# Altium schematic sheet PCU_PCIe.SchDoc
size B
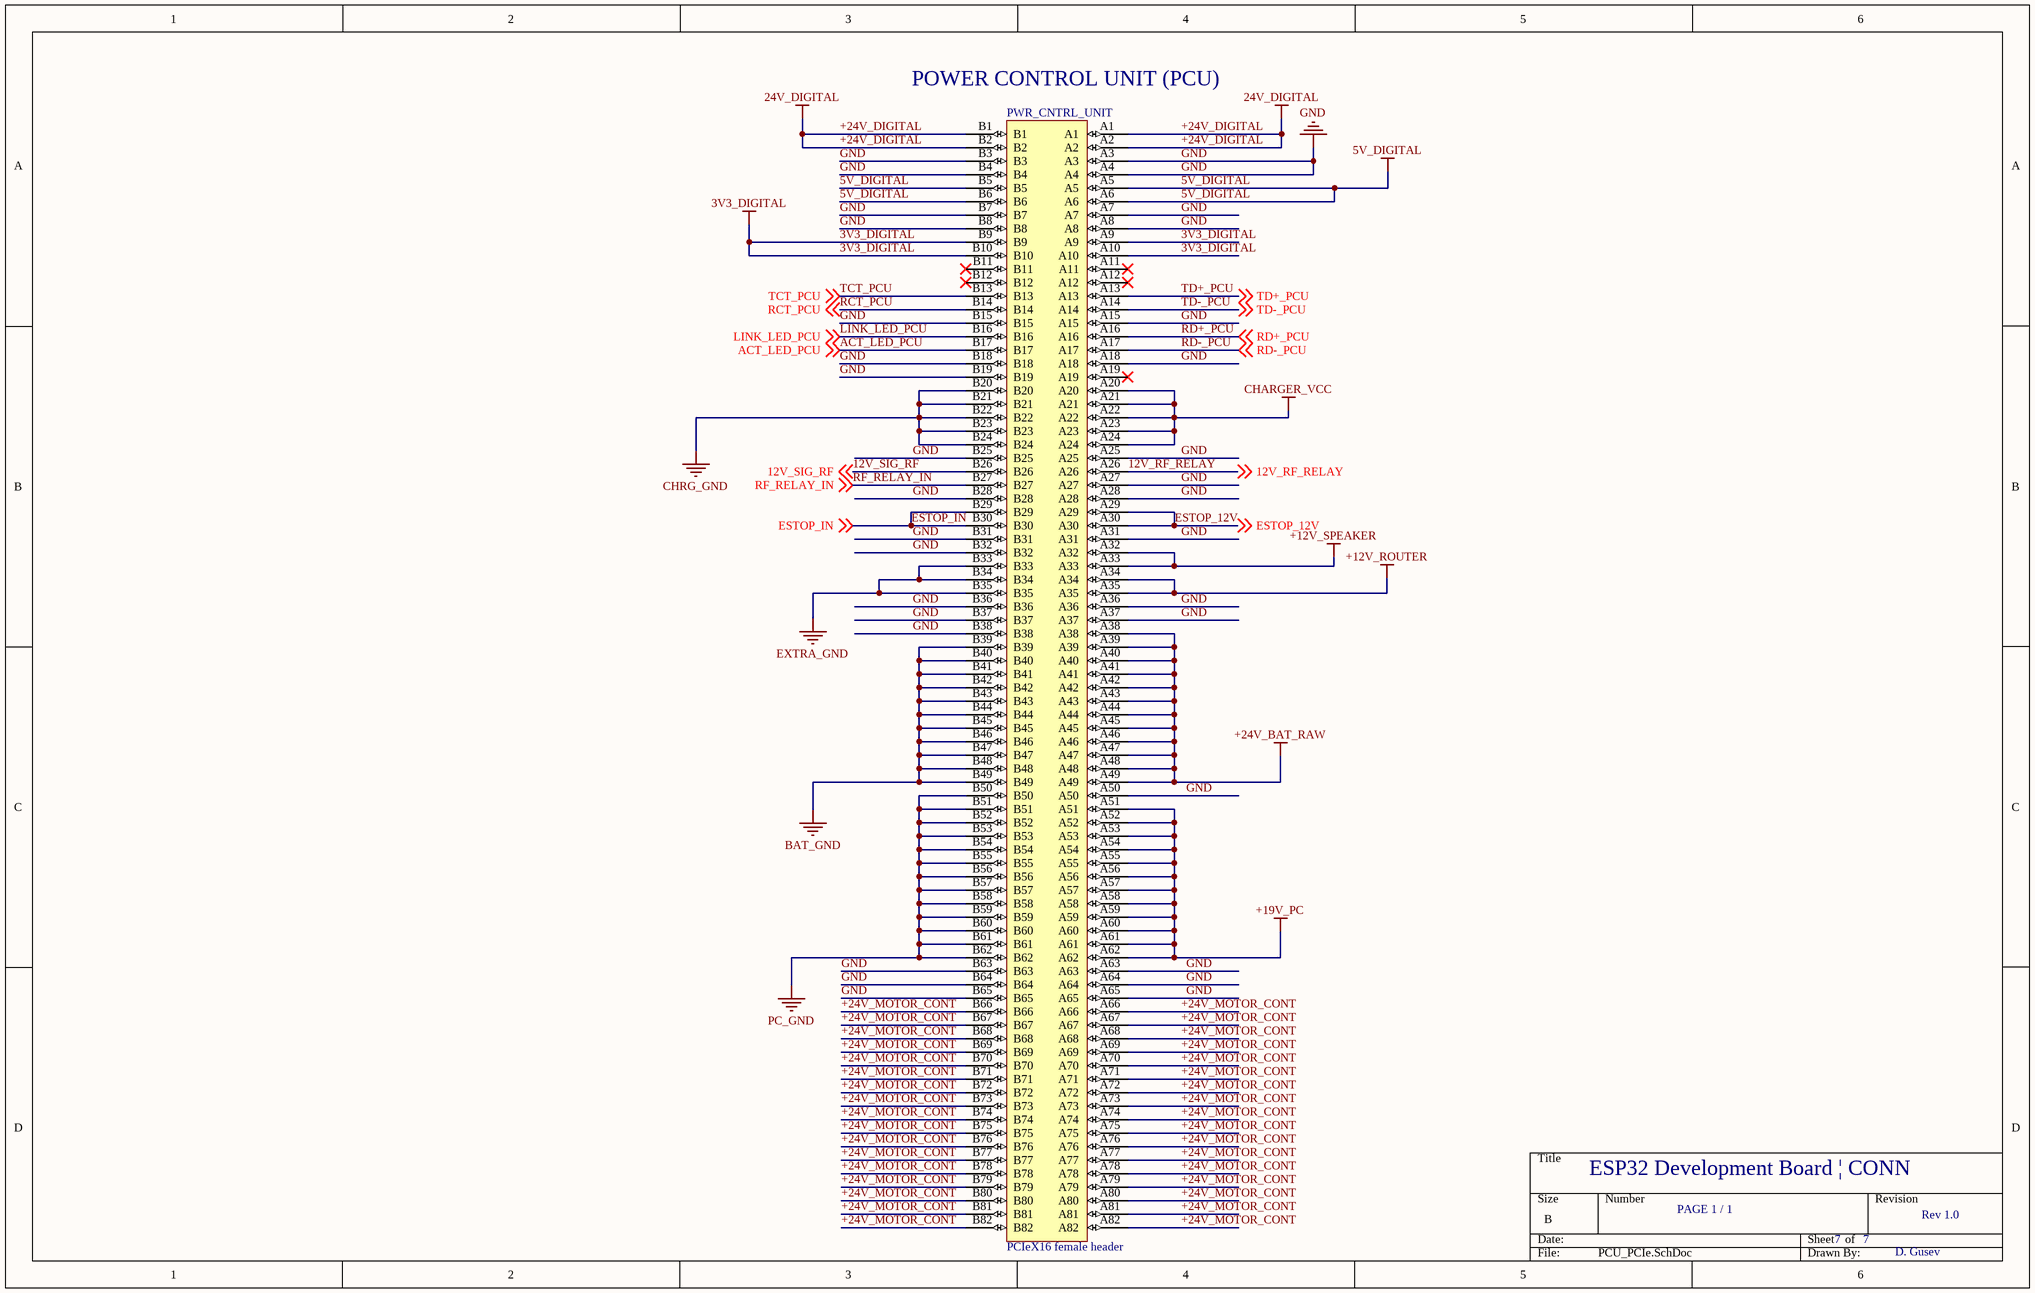
[diagram p0: PCU_PCIe.SchDoc]

## Parts
PWR_CNTRL_UNIT  PCIeX16 female header  [SAMTEC_PCIE-164-02-X-D-TH]

## Nets
3V3_DIGITAL: PWR_CNTRL_UNIT.A9 PWR_CNTRL_UNIT.A10 PWR_CNTRL_UNIT.B9 PWR_CNTRL_UNIT.B10
5V_DIGITAL: PWR_CNTRL_UNIT.A5 PWR_CNTRL_UNIT.A6 PWR_CNTRL_UNIT.B5 PWR_CNTRL_UNIT.B6
+12V_ROUTER: PWR_CNTRL_UNIT.A34 PWR_CNTRL_UNIT.A35
+12V_SPEAKER: PWR_CNTRL_UNIT.A32 PWR_CNTRL_UNIT.A33
+19V_PC: PWR_CNTRL_UNIT.A51 PWR_CNTRL_UNIT.A52 PWR_CNTRL_UNIT.A53 PWR_CNTRL_UNIT.A54 PWR_CNTRL_UNIT.A55 PWR_CNTRL_UNIT.A56 PWR_CNTRL_UNIT.A57 PWR_CNTRL_UNIT.A58 PWR_CNTRL_UNIT.A59 PWR_CNTRL_UNIT.A60 PWR_CNTRL_UNIT.A61 PWR_CNTRL_UNIT.A62
+24V_BAT_RAW: PWR_CNTRL_UNIT.A38 PWR_CNTRL_UNIT.A39 PWR_CNTRL_UNIT.A40 PWR_CNTRL_UNIT.A41 PWR_CNTRL_UNIT.A42 PWR_CNTRL_UNIT.A43 PWR_CNTRL_UNIT.A44 PWR_CNTRL_UNIT.A45 PWR_CNTRL_UNIT.A46 PWR_CNTRL_UNIT.A47 PWR_CNTRL_UNIT.A48 PWR_CNTRL_UNIT.A49
+24V_DIGITAL: PWR_CNTRL_UNIT.A1 PWR_CNTRL_UNIT.A2 PWR_CNTRL_UNIT.B1 PWR_CNTRL_UNIT.B2  [also labelled 24V_DIGITAL]
BAT_GND: PWR_CNTRL_UNIT.B39 PWR_CNTRL_UNIT.B40 PWR_CNTRL_UNIT.B41 PWR_CNTRL_UNIT.B42 PWR_CNTRL_UNIT.B43 PWR_CNTRL_UNIT.B44 PWR_CNTRL_UNIT.B45 PWR_CNTRL_UNIT.B46 PWR_CNTRL_UNIT.B47 PWR_CNTRL_UNIT.B48 PWR_CNTRL_UNIT.B49
CHARGER_VCC: PWR_CNTRL_UNIT.A20 PWR_CNTRL_UNIT.A21 PWR_CNTRL_UNIT.A22 PWR_CNTRL_UNIT.A23 PWR_CNTRL_UNIT.A24
CHRG_GND: PWR_CNTRL_UNIT.B20 PWR_CNTRL_UNIT.B21 PWR_CNTRL_UNIT.B22 PWR_CNTRL_UNIT.B23 PWR_CNTRL_UNIT.B24
EXTRA_GND: PWR_CNTRL_UNIT.B33 PWR_CNTRL_UNIT.B34 PWR_CNTRL_UNIT.B35
GND: PWR_CNTRL_UNIT.A3 PWR_CNTRL_UNIT.A4 PWR_CNTRL_UNIT.A7 PWR_CNTRL_UNIT.A8 PWR_CNTRL_UNIT.A15 PWR_CNTRL_UNIT.A18 PWR_CNTRL_UNIT.A25 PWR_CNTRL_UNIT.A27 PWR_CNTRL_UNIT.A28 PWR_CNTRL_UNIT.A31 PWR_CNTRL_UNIT.A36 PWR_CNTRL_UNIT.A37 PWR_CNTRL_UNIT.A50 PWR_CNTRL_UNIT.A63 PWR_CNTRL_UNIT.A64 PWR_CNTRL_UNIT.A65 PWR_CNTRL_UNIT.B3 PWR_CNTRL_UNIT.B4 PWR_CNTRL_UNIT.B7 PWR_CNTRL_UNIT.B8 PWR_CNTRL_UNIT.B15 PWR_CNTRL_UNIT.B18 PWR_CNTRL_UNIT.B19 PWR_CNTRL_UNIT.B25 PWR_CNTRL_UNIT.B28 PWR_CNTRL_UNIT.B31 PWR_CNTRL_UNIT.B32 PWR_CNTRL_UNIT.B36 PWR_CNTRL_UNIT.B37 PWR_CNTRL_UNIT.B38 PWR_CNTRL_UNIT.B63 PWR_CNTRL_UNIT.B64 PWR_CNTRL_UNIT.B65
PC_GND: PWR_CNTRL_UNIT.B50 PWR_CNTRL_UNIT.B51 PWR_CNTRL_UNIT.B52 PWR_CNTRL_UNIT.B53 PWR_CNTRL_UNIT.B54 PWR_CNTRL_UNIT.B55 PWR_CNTRL_UNIT.B56 PWR_CNTRL_UNIT.B57 PWR_CNTRL_UNIT.B58 PWR_CNTRL_UNIT.B59 PWR_CNTRL_UNIT.B60 PWR_CNTRL_UNIT.B61 PWR_CNTRL_UNIT.B62
12V_RF_RELAY: PWR_CNTRL_UNIT.A26 ; off-sheet 12V_RF_RELAY
12V_SIG_RF: PWR_CNTRL_UNIT.B26 ; off-sheet 12V_SIG_RF
+24V_MOTOR_CONT: PWR_CNTRL_UNIT.A66 PWR_CNTRL_UNIT.A67 PWR_CNTRL_UNIT.A68 PWR_CNTRL_UNIT.A69 PWR_CNTRL_UNIT.A70 PWR_CNTRL_UNIT.A71 PWR_CNTRL_UNIT.A72 PWR_CNTRL_UNIT.A73 PWR_CNTRL_UNIT.A74 PWR_CNTRL_UNIT.A75 PWR_CNTRL_UNIT.A76 PWR_CNTRL_UNIT.A77 PWR_CNTRL_UNIT.A78 PWR_CNTRL_UNIT.A79 PWR_CNTRL_UNIT.A80 PWR_CNTRL_UNIT.A81 PWR_CNTRL_UNIT.A82 PWR_CNTRL_UNIT.B66 PWR_CNTRL_UNIT.B67 PWR_CNTRL_UNIT.B68 PWR_CNTRL_UNIT.B69 PWR_CNTRL_UNIT.B70 PWR_CNTRL_UNIT.B71 PWR_CNTRL_UNIT.B72 PWR_CNTRL_UNIT.B73 PWR_CNTRL_UNIT.B74 PWR_CNTRL_UNIT.B75 PWR_CNTRL_UNIT.B76 PWR_CNTRL_UNIT.B77 PWR_CNTRL_UNIT.B78 PWR_CNTRL_UNIT.B79 PWR_CNTRL_UNIT.B80 PWR_CNTRL_UNIT.B81 PWR_CNTRL_UNIT.B82
ACT_LED_PCU: PWR_CNTRL_UNIT.B17 ; off-sheet ACT_LED_PCU
ESTOP_12V: PWR_CNTRL_UNIT.A29 PWR_CNTRL_UNIT.A30 ; off-sheet ESTOP_12V
ESTOP_IN: PWR_CNTRL_UNIT.B29 PWR_CNTRL_UNIT.B30 ; off-sheet ESTOP_IN
LINK_LED_PCU: PWR_CNTRL_UNIT.B16 ; off-sheet LINK_LED_PCU
RCT_PCU: PWR_CNTRL_UNIT.B14 ; off-sheet RCT_PCU
RD+_PCU: PWR_CNTRL_UNIT.A16 ; off-sheet RD+_PCU
RD-_PCU: PWR_CNTRL_UNIT.A17 ; off-sheet RD-_PCU
RF_RELAY_IN: PWR_CNTRL_UNIT.B27 ; off-sheet RF_RELAY_IN
TCT_PCU: PWR_CNTRL_UNIT.B13 ; off-sheet TCT_PCU
TD+_PCU: PWR_CNTRL_UNIT.A13 ; off-sheet TD+_PCU
TD-_PCU: PWR_CNTRL_UNIT.A14 ; off-sheet TD-_PCU

Not connected (* = marked no-connect by the designer): PWR_CNTRL_UNIT A11* A12* A19* B11* B12*

## Notes on the sheet
- (near PWR_CNTRL_UNIT) POWER CONTROL UNIT (PCU)
- ESP32 Development Board | CONN
- PAGE 1 / 1
- 7
- Rev 1.0
- D. Gusev

## Library data of the parts
PWR_CNTRL_UNIT = PCIeX16 female header: 164-position SAMTEC female header